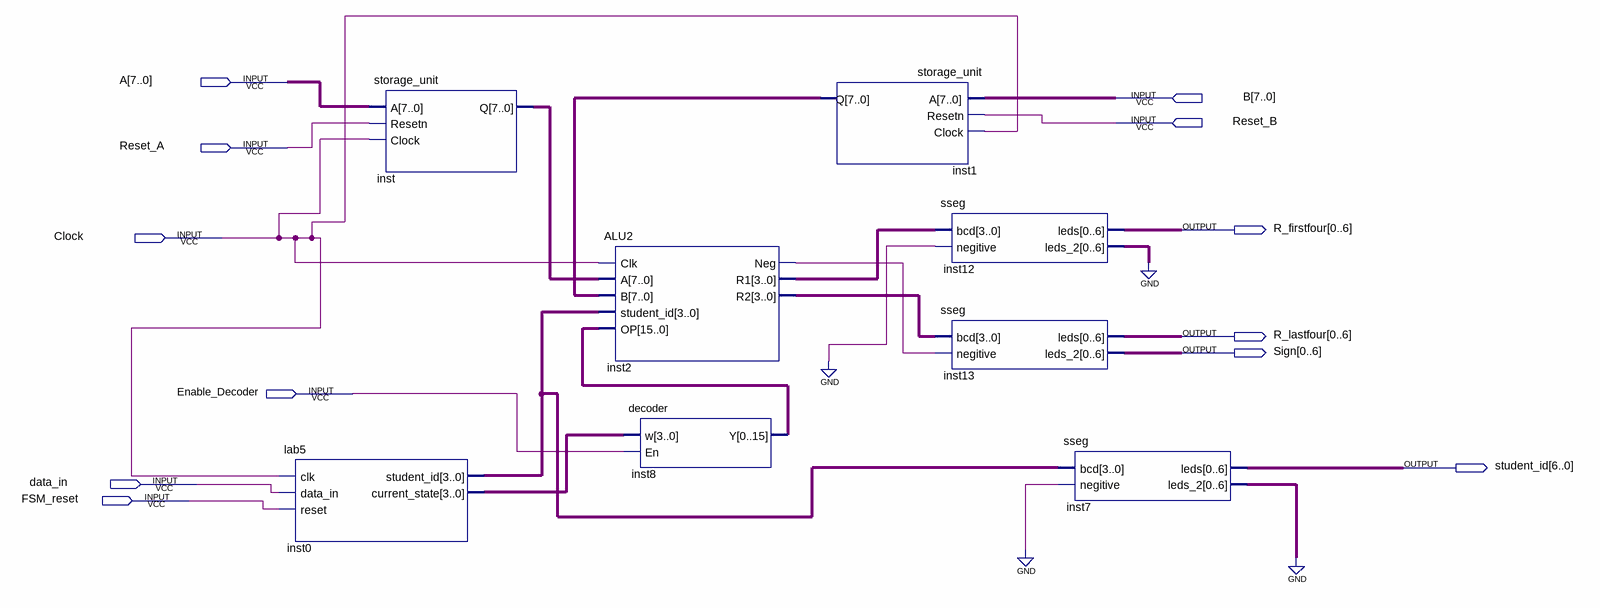
[diagram p0: schematic sheet]
// Quartus schematic prob_set2.bdf as structural Verilog: 8 symbols, 12 pins
module prob_set2 (
  input  [7:0] A,
  input  [7:0] B,
  input  Reset_B,
  input  Reset_A,
  input  Clock,
  input  Enable_Decoder,
  input  data_in,
  input  FSM_reset,
  output [0:6] R_firstfour,
  output [0:6] R_lastfour,
  output [0:6] Sign,
  output [6:0] student_id
);

  wire inst2_neg;
  wire [3:0] inst0_current_state, inst0_student_id, inst2_r1, inst2_r2;
  wire [6:0] inst7_leds_2, inst12_leds_2;
  wire [7:0] inst1_q, inst_q;
  wire [15:0] inst8_y;

  lab5 inst0 (
    .clk(Clock), .data_in(data_in), .reset(FSM_reset), .student_id(inst0_student_id),
    .current_state(inst0_current_state));
  storage_unit inst (.A(A), .Resetn(Reset_A), .Clock(Clock), .Q(inst_q));
  ALU2 inst2 (
    .Clk(Clock), .A(inst_q), .B(inst1_q), .student_id(inst0_student_id), .OP(inst8_y), .Neg(inst2_neg),
    .R1(inst2_r1), .R2(inst2_r2));
  decoder inst8 (.w(inst0_current_state), .En(Enable_Decoder), .Y(inst8_y));
  storage_unit inst1 (.A(B), .Resetn(Reset_B), .Clock(Clock), .Q(inst1_q));
  sseg inst12 (.bcd(inst2_r1), .negitive(1'b0), .leds(R_firstfour), .leds_2(inst12_leds_2));
  sseg inst13 (.bcd(inst2_r2), .negitive(inst2_neg), .leds(R_lastfour), .leds_2(Sign));
  sseg inst7 (.bcd(inst0_student_id), .negitive(1'b0), .leds(student_id), .leds_2(inst7_leds_2));
  // also tied to GND on the sheet: {inst7_leds_2[0], inst7_leds_2[1], inst7_leds_2[2], inst7_leds_2[3], inst7_leds_2[4], inst7_leds_2[5], inst7_leds_2[6], inst12_leds_2[0], inst12_leds_2[1], inst12_leds_2[2], inst12_leds_2[3], inst12_leds_2[4], inst12_leds_2[5], inst12_leds_2[6]}
endmodule
